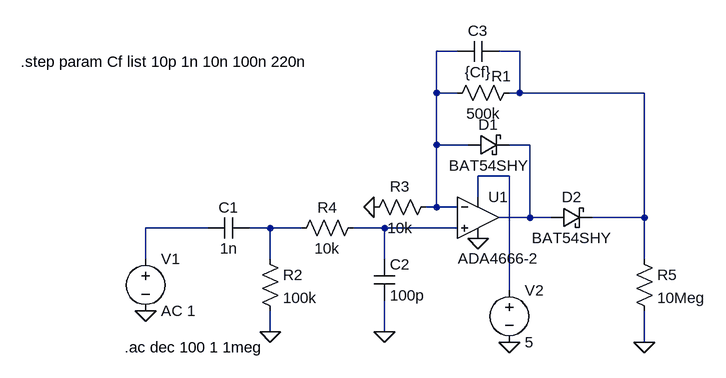
[diagram p0: schematic Opamp-AC.asc]
Opamp-AC.asc, the LTspice schematic file:
Version 4
SHEET 1 1016 680
WIRE 624 -192 592 -192
WIRE 720 -192 688 -192
WIRE 592 -128 592 -192
WIRE 624 -128 592 -128
WIRE 720 -128 720 -192
WIRE 720 -128 704 -128
WIRE 912 -128 720 -128
WIRE 592 -48 592 -128
WIRE 640 -48 592 -48
WIRE 736 -48 704 -48
WIRE 704 0 656 0
WIRE 656 32 656 0
WIRE 592 48 592 -48
WIRE 592 48 576 48
WIRE 624 48 592 48
WIRE 736 64 736 -48
WIRE 736 64 688 64
WIRE 768 64 736 64
WIRE 912 64 912 -128
WIRE 912 64 832 64
WIRE 240 80 144 80
WIRE 336 80 304 80
WIRE 384 80 336 80
WIRE 512 80 464 80
WIRE 624 80 512 80
WIRE 144 128 144 80
WIRE 336 128 336 80
WIRE 512 128 512 80
WIRE 912 128 912 64
WIRE 704 176 704 0
WIRE 336 240 336 208
WIRE 512 240 512 192
WIRE 912 256 912 208
FLAG 144 208 0
FLAG 336 240 0
FLAG 656 96 0
FLAG 496 48 0
FLAG 704 256 0
FLAG 512 240 0
FLAG 912 256 0
SYMBOL voltage 144 112 R0
WINDOW 123 0 0 Left 0
WINDOW 39 0 0 Left 0
SYMATTR InstName V1
SYMATTR Value AC 1
SYMBOL cap 304 64 R90
WINDOW 0 0 32 VBottom 2
WINDOW 3 32 32 VTop 2
SYMATTR InstName C1
SYMATTR Value 1n
SYMBOL res 320 112 R0
SYMATTR InstName R2
SYMATTR Value 100k
SYMBOL OpAmps\\ADA4666-2 656 0 R0
WINDOW 3 -31 127 Left 2
SYMATTR InstName U1
SYMBOL res 720 -144 R90
WINDOW 0 6 28 VBottom 2
WINDOW 3 32 56 VTop 2
SYMATTR InstName R1
SYMATTR Value 500k
SYMBOL res 592 32 R90
WINDOW 0 0 56 VBottom 2
WINDOW 3 32 56 VTop 2
SYMATTR InstName R3
SYMATTR Value 10k
SYMBOL schottky 640 -32 R270
WINDOW 0 32 32 VTop 2
WINDOW 3 0 32 VBottom 2
SYMATTR InstName D1
SYMATTR Value BAT54SHY
SYMATTR Description Diode
SYMATTR Type diode
SYMBOL schottky 768 80 R270
WINDOW 0 32 32 VTop 2
WINDOW 3 0 32 VBottom 2
SYMATTR InstName D2
SYMATTR Value BAT54SHY
SYMATTR Description Diode
SYMATTR Type diode
SYMBOL cap 688 -208 R90
WINDOW 0 0 32 VBottom 2
WINDOW 3 32 32 VTop 2
SYMATTR InstName C3
SYMATTR Value {Cf}
SYMBOL voltage 704 160 R0
WINDOW 123 0 0 Left 0
WINDOW 39 0 0 Left 0
SYMATTR InstName V2
SYMATTR Value 5
SYMBOL cap 496 128 R0
SYMATTR InstName C2
SYMATTR Value 100p
SYMBOL res 480 64 R90
WINDOW 0 0 56 VBottom 2
WINDOW 3 32 56 VTop 2
SYMATTR InstName R4
SYMATTR Value 10k
SYMBOL res 896 112 R0
SYMATTR InstName R5
SYMATTR Value 10Meg
TEXT 112 264 Left 2 !.ac dec 100 1 1meg
TEXT -48 -176 Left 2 !.step param Cf list 10p 1n 10n 100n 220n

The netlist it stands for:
* Opamp-AC.asc
V1 N005 0 AC 1
C1 N006 N005 1n
R2 N006 0 100k
XU1 N007 N001 N004 0 N003 ADA4666-2  ; pins In+ In- V+ V- OUT
R1 N002 N001 500k
R3 N001 0 10k
D1 N001 N003 BAT54SHY
D2 N003 N002 BAT54SHY
C3 N002 N001 {Cf}
V2 N004 0 5
C2 N007 0 100p
R4 N007 N006 10k
R5 N002 0 10Meg
.model D D
.lib standard.dio
.ac dec 100 1 1meg
.step param Cf list 10p 1n 10n 100n 220n
.backanno
.end